# EAGLE design homecontrol (EAGLE 6.3)
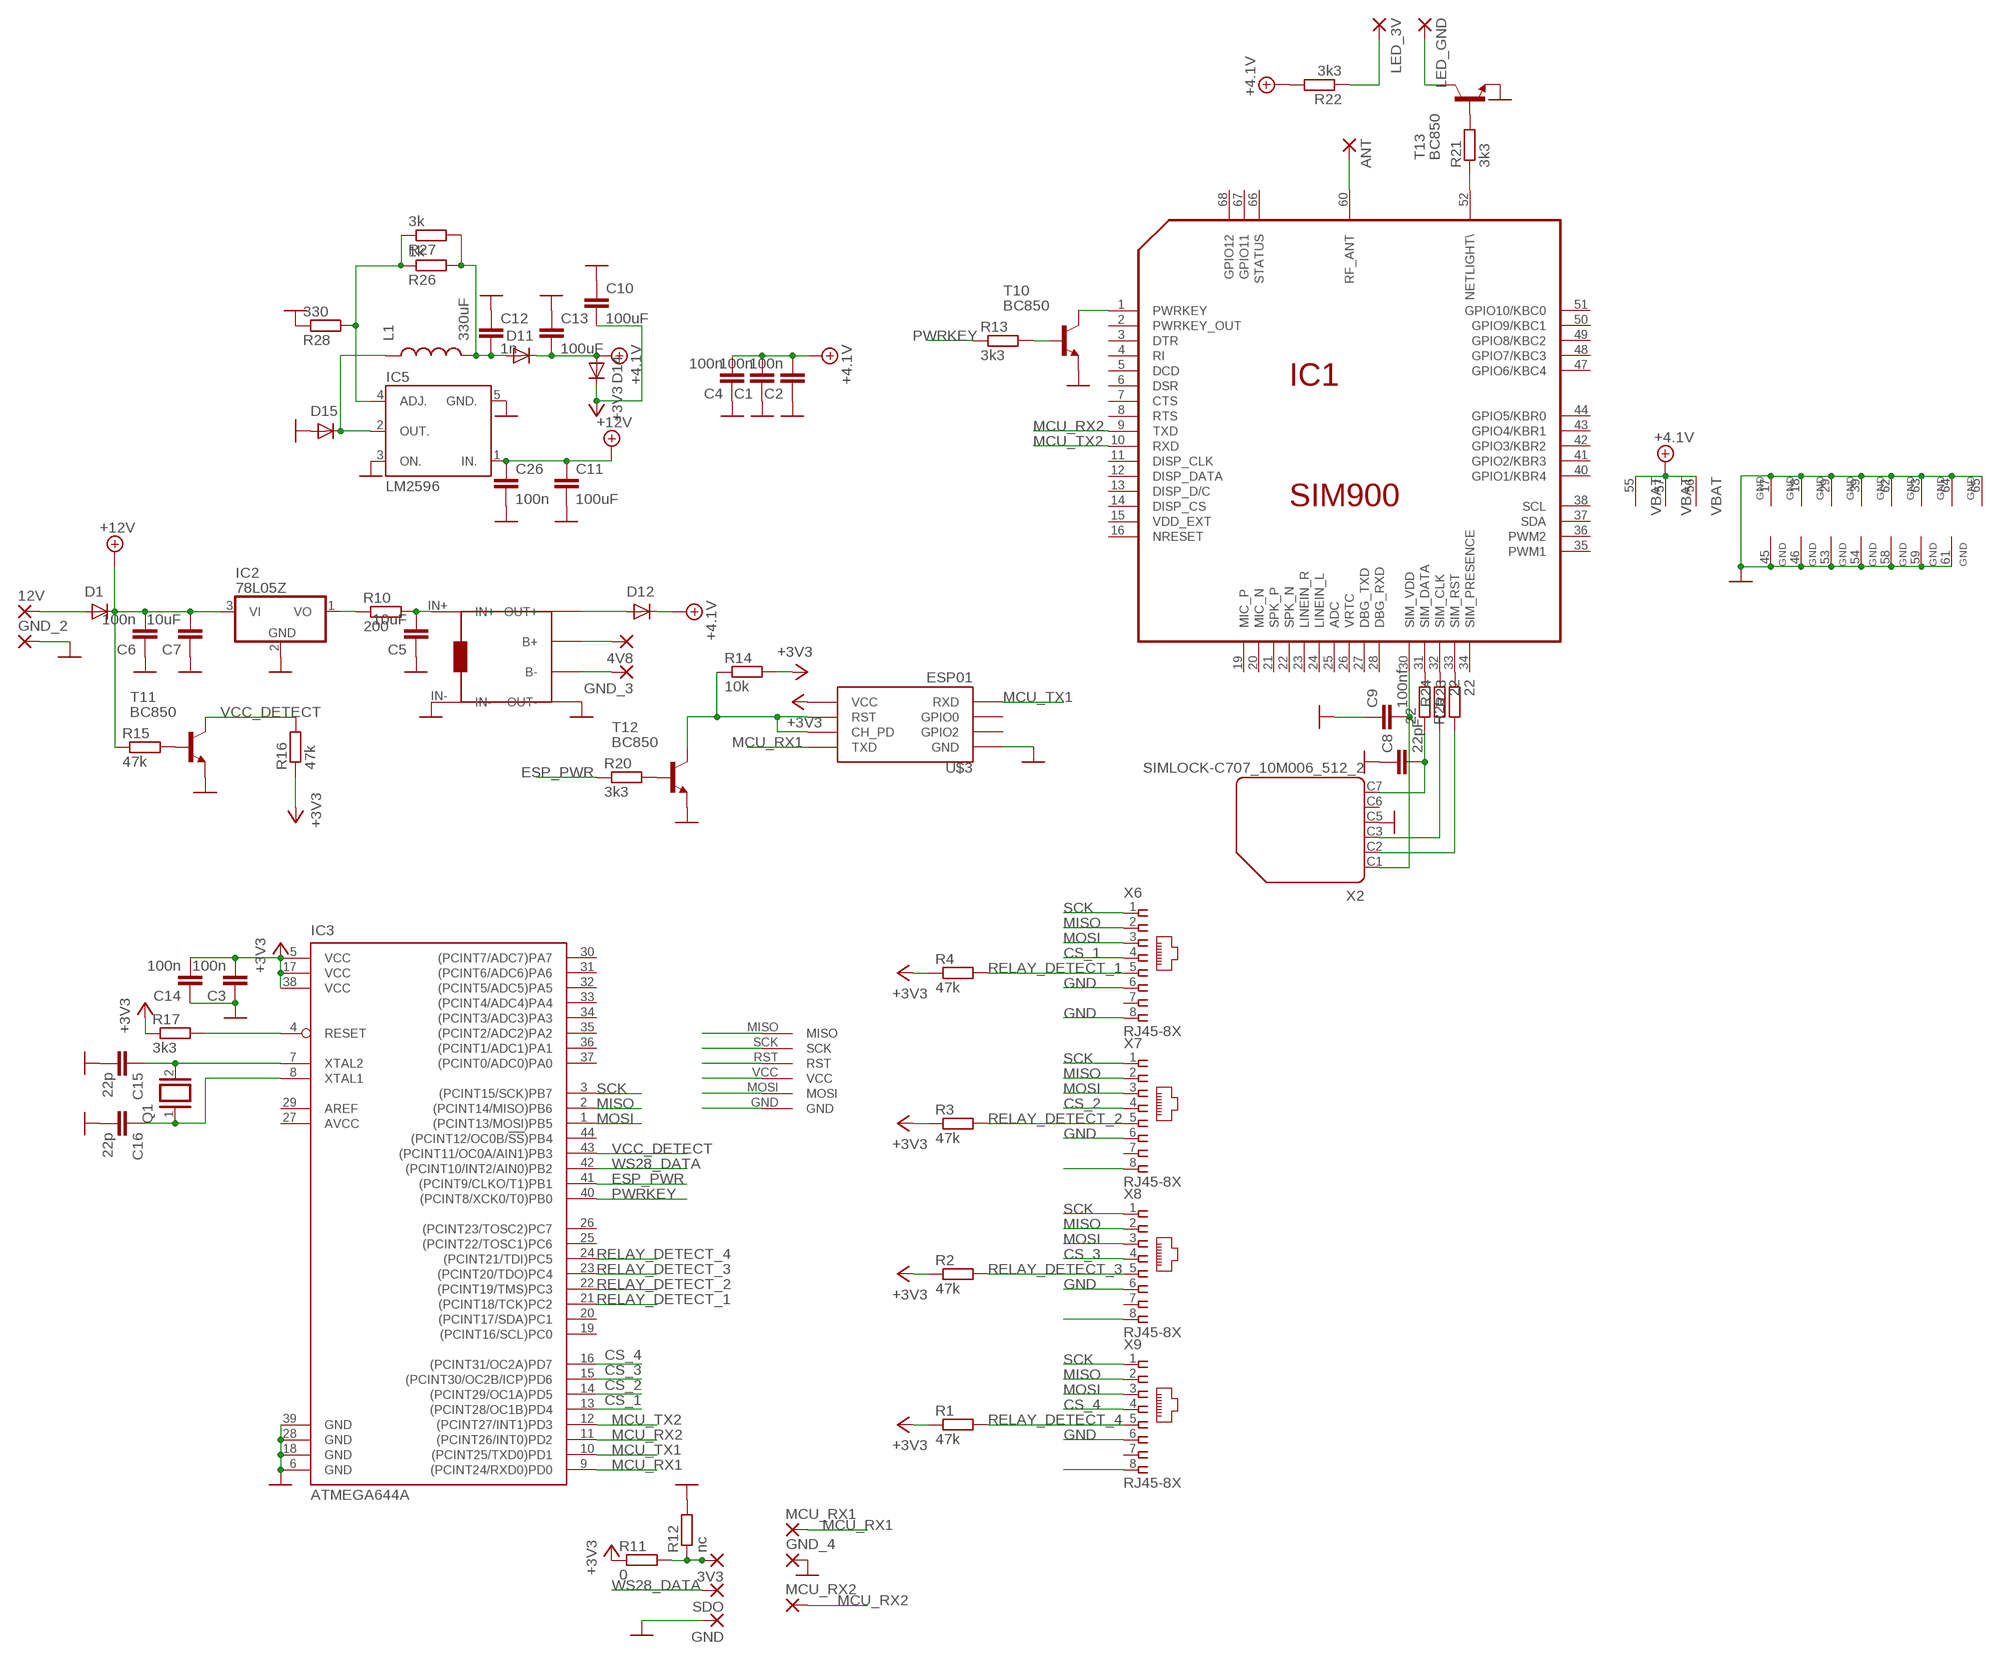
[diagram p0: schematic, sheet 1]

## Parts
3V3  2,15/1,0  [2,15/1,0]
4V8  WIREPAD2,15/1,0  [2,15/1,0]
12V  2,54/0,8  [2,54/0,8]
ANT  2,54/0,8  [2,54/0,8]
C1  100n  C-EUC1206  [C1206]
C2  100n  C-EUC1206  [C1206]
C3  100n  C-EUC1206  [C1206]
C4  100n  C-EUC1206  [C1206]
C5  10uF  C-EUC1206  [C1206]
C6  100n  C-EUC1206  [C1206]
C7  10uF  C-EUC1206  [C1206]
C8  22pF  C-EUC1206K  [C1206K]
C9  100nf  C-EUC1206K  [C1206K]
C10  100uF  SMD-CAP  [SMD-CAP]
C11  100uF  SMD-CAP  [SMD-CAP]
C12  1n  C-EUC1206K  [C1206K]
C13  100uF  C-EU025-050X050  [C025-050X050]
C14  100n  C-EUC1206  [C1206]
C15  22p  C-EUC1206  [C1206]
C16  22p  C-EUC1206  [C1206]
C26  100n  C-EUC1206K  [C1206K]
D1  GF1  [SMA-DO214AC]
D11  GF1  [SMA-DO214AC]
D12  GF1  [SMA-DO214AC]
D14  GF1  [SMA-DO214AC]
D15  GF1  [SMA-DO214AC]
GND  2,54/0,8  [2,54/0,8]
GND_2  2,15/1,0  [2,15/1,0]
GND_3  2,15/1,0  [2,15/1,0]
GND_4  2,15/1,0  [2,15/1,0]
IC1  SIM900  [SIM900]
IC2  78L05Z  [TO92]
IC3  ATMEGA644A  [TQFP44]
IC5  LM2596  LM2931S-ADJ  [TO263-5]
L1  330uF  SMD-INDUCTOR  [SMD-COIL]
LED_3V  WIREPAD2,15/1,0  [2,15/1,0]
LED_GND  WIREPAD2,15/1,0  [2,15/1,0]
MCU_RX1  2,15/1,0  [2,15/1,0]
MCU_RX2  2,15/1,0  [2,15/1,0]
Q1  XTAL/S  [QS]
R1  47k  R-EU_M3216  [M3216]
R2  47k  R-EU_M3216  [M3216]
R3  47k  R-EU_M3216  [M3216]
R4  47k  R-EU_M3216  [M3216]
R10  200  R-EU_M3216  [M3216]
R11  0  R-EU_M3216  [M3216]
R12  nc  R-EU_M3216  [M3216]
R13  3k3  R-EU_M3216  [M3216]
R14  10k  R-EU_M3216  [M3216]
R15  47k  R-EU_M3216  [M3216]
R16  47k  R-EU_M3216  [M3216]
R17  3k3  R-EU_M3216  [M3216]
R20  3k3  R-EU_M3216  [M3216]
R21  3k3  R-EU_M3216  [M3216]
R22  3k3  R-EU_M3216  [M3216]
R23  22  R-EU_M1206  [M1206]
R24  22  R-EU_M1206  [M1206]
R25  22  R-EU_M1206  [M1206]
R26  1k  R-EU_M3216  [M3216]
R27  3k  R-EU_M3216  [M3216]
R28  330  R-EU_M3216  [M3216]
SDO  2,15/1,0  [2,15/1,0]
T10  BC850  [SOT23]
T11  BC850  [SOT23]
T12  BC850  [SOT23]
T13  BC850  [SOT23]
U$1  AVR_ISP  [AVR_ISP]
U$2  AKUTOLTO  [AKUTOLTO]
U$3  ESP01  [ESP01]
X2  SIMLOCK-C707_10M006_512_2  [C707_10M006_512_2]
X6  RJ45-8X  [RJ45-NO-SHIELD]
X7  RJ45-8X  [RJ45-NO-SHIELD]
X8  RJ45-8X  [RJ45-NO-SHIELD]
X9  RJ45-8X  [RJ45-NO-SHIELD]

## Nets
+3V3: C3.2 C10.P$2 C14.2 D14.K(C) IC3.5(VCC) IC3.17(VCC) IC3.38(VCC) R1.1 R2.1 R3.1 R4.1 R11.1 R14.2 R16.1 R17.1 U$1.VCC U$3.VCC
+4.1V: C1.2 C2.2 C4.2 C13.2 D11.K(C) D12.K(C) D14.A IC1.55(VBAT) IC1.56(VBAT) IC1.57(VBAT) R22.2
+12V: C6.2 C7.2 C11.P$1 C26.1 D1.K(C) IC2.3(VI) IC5.1(IN.) R15.1
CS_1: IC3.13((PCINT28/OC1B)PD4) X6.4
CS_2: IC3.14((PCINT29/OC1A)PD5) X7.4
CS_3: IC3.15((PCINT30/OC2B/ICP)PD6) X8.4
CS_4: IC3.16((PCINT31/OC2A)PD7) X9.4
ESP_PWR: IC3.41((PCINT9/CLKO/T1)PB1) R20.1
GND: C1.1 C2.1 C3.1 C4.1 C5.1 C6.1 C7.1 C8.1 C9.1 C10.P$1 C11.P$2 C12.1 C13.1 C14.1 C15.2 C16.2 C26.2 D15.A GND.1(P) GND_2.1(P) GND_4.1(P) IC1.17(GND) IC1.18(GND) IC1.29(GND) IC1.39(GND) IC1.45(GND) IC1.46(GND) IC1.53(GND) IC1.54(GND) IC1.58(GND) IC1.59(GND) IC1.61(GND) IC1.62(GND) IC1.63(GND) IC1.64(GND) IC1.65(GND) IC2.2(GND) IC3.6(GND) IC3.18(GND) IC3.28(GND) IC3.39(GND) IC5.3(ON.) IC5.5(GND.) R12.2 R28.1 T10.2(E) T11.2(E) T12.2(E) T13.2(E) U$1.GND U$2.IN- U$2.OUT- U$3.GND X2.C5 X6.6 X6.8 X7.6 X7.8 X8.6 X8.8 X9.6 X9.8
MCU_RX1: IC3.9((PCINT24/RXD0)PD0) MCU_RX1.1(P) U$3.TX(TXD)
MCU_RX2: IC1.9(TXD) IC3.11((PCINT26/INT0)PD2) MCU_RX2.1(P)
MCU_TX1: IC3.10((PCINT25/TXD0)PD1) U$3.RX(RXD)
MCU_TX2: IC1.10(RXD) IC3.12((PCINT27/INT1)PD3)
MISO: IC3.2((PCINT14/MISO)PB6) U$1.MISO X6.2 X7.2 X8.2 X9.2
MOSI: IC3.1((PCINT13/MOSI)PB5) U$1.MOSI X6.3 X7.3 X8.3 X9.3
N$1: C12.2 D11.A L1.P$2 R26.2 R27.2
N$46: C5.2 R10.2 U$2.IN+
N$47: D12.A U$2.OUT+
N$48: IC2.1(VO) R10.1
N$50: 3V3.1(P) R11.2 R12.1
N$51: R13.2 T10.1(B)
N$52: IC1.1(PWRKEY) T10.3(C)
N$53: D15.K(C) IC5.2(OUT.) L1.P$1
N$54: 12V.1(P) D1.A
N$55: R14.1 T12.3(C) U$3.CH_PD U$3.RST
N$56: 4V8.1(P) U$2.B+
N$57: R15.2 T11.1(B)
N$58: GND_3.1(P) U$2.B-
N$61: C15.1 IC3.7(XTAL2) Q1.2
N$62: R20.2 T12.1(B)
N$63: IC5.4(ADJ.) R26.1 R27.1 R28.2
N$64: ANT.1(P) IC1.60(RF_ANT)
N$65: IC1.52(NETLIGHT\) R21.1
N$66: R21.2 T13.1(B)
N$67: LED_GND.1(P) T13.3(C)
N$68: LED_3V.1(P) R22.1
N$69: C9.2 IC1.30(SIM_VDD) X2.C1
N$70: R23.2 X2.C2
N$71: R24.2 X2.C3
N$72: C8.2 R25.1 X2.C7
N$73: IC1.33(SIM_RST) R23.1
N$74: IC1.32(SIM_CLK) R24.1
N$75: IC1.31(SIM_DATA) R25.2
N$79: C16.1 IC3.8(XTAL1) Q1.1
PWRKEY: IC3.40((PCINT8/XCK0/T0)PB0) R13.1
RELAY_DETECT_1: IC3.21((PCINT18/TCK)PC2) R4.2 X6.5
RELAY_DETECT_2: IC3.22((PCINT19/TMS)PC3) R3.2 X7.5
RELAY_DETECT_3: IC3.23((PCINT20/TDO)PC4) R2.2 X8.5
RELAY_DETECT_4: IC3.24((PCINT21/TDI)PC5) R1.2 X9.5
RESET: IC3.4(RESET) R17.2 U$1.RST
SCK: IC3.3((PCINT15/SCK)PB7) U$1.SCK X6.1 X7.1 X8.1 X9.1
VCC_DETECT: IC3.43((PCINT11/OC0A/AIN1)PB3) R16.2 T11.3(C)
WS28_DATA: IC3.42((PCINT10/INT2/AIN0)PB2) SDO.1(P)
Unconnected: IC1.2(PWRKEY_OUT) IC1.3(DTR) IC1.4(RI) IC1.5(DCD) IC1.6(DSR) IC1.7(CTS) IC1.8(RTS) IC1.11(DISP_CLK) IC1.12(DISP_DATA) IC1.13(DISP_D/C) IC1.14(DISP_CS) IC1.15(VDD_EXT) IC1.16(NRESET) IC1.19(MIC_P) IC1.20(MIC_N) IC1.21(SPK_P) IC1.22(SPK_N) IC1.23(LINEIN_R) IC1.24(LINEIN_L) IC1.25(ADC) IC1.26(VRTC) IC1.27(DBG_TXD) IC1.28(DBG_RXD) IC1.34(SIM_PRESENCE) IC1.35(PWM1) IC1.36(PWM2) IC1.37(SDA) IC1.38(SCL) IC1.40(GPIO1/KBR4) IC1.41(GPIO2/KBR3) IC1.42(GPIO3/KBR2) IC1.43(GPIO4/KBR1) IC1.44(GPIO5/KBR0) IC1.47(GPIO6/KBC4) IC1.48(GPIO7/KBC3) IC1.49(GPIO8/KBC2) IC1.50(GPIO9/KBC1) IC1.51(GPIO10/KBC0) IC1.66(STATUS) IC1.67(GPIO11) IC1.68(GPIO12) IC3.19((PCINT16/SCL)PC0) IC3.20((PCINT17/SDA)PC1) IC3.25((PCINT22/TOSC1)PC6) IC3.26((PCINT23/TOSC2)PC7) IC3.29(AREF) IC3.30((PCINT7/ADC7)PA7) IC3.31((PCINT6/ADC6)PA6) IC3.32((PCINT5/ADC5)PA5) IC3.33((PCINT4/ADC4)PA4) IC3.34((PCINT3/ADC3)PA3) IC3.35((PCINT2/ADC2)PA2) IC3.36((PCINT1/ADC1)PA1) IC3.37((PCINT0/ADC0)PA0) IC3.44((PCINT12/OC0B/!SS!)PB4) U$3.GPIO0 U$3.GPIO2 X2.C6 X6.7 X7.7 X8.7 X9.7

## Power pins joined to a net without a drawn wire
AVCC: IC3.27(AVCC)

## Library data of the parts
3V3 GND_2-GND_4 MCU_RX1 MCU_RX2 SDO = wirepad:2,15/1,0: THROUGH-HOLE PAD
4V8 LED_3V LED_GND = wirepad:WIREPAD: Wire PAD connect wire on PCB
12V ANT GND = wirepad:2,54/0,8: THROUGH-HOLE PAD
C1-C7 C14-C16 = resistor:C-EU: CAPACITOR, European symbol
C8 C9 C12 C13 C26 = rcl:C-EU: CAPACITOR, European symbol
C10 C11 = Tomi's_Library:SMD-CAP
D1 D11 D12 D14 D15 = diode:GF1: DIODE
IC1 = sim900:SIM900
IC2 = linear:78*: Positive VOLTAGE REGULATOR Source: http://cache.national.com/ds/LM/LM78L05.pdf http://www.fairchildsemi.com/ds/LM/LM7805.pdf
IC3 = atmel:ATMEGA644: 8-bit Microcontroller with 64K Bytes In-System Programmable Flash Source: http://www.atmel.com/dyn/resources/prod_documents/doc2593.pdf; MPN: ATMEGA644PV-10AU; OC_FARNELL: 1455123; OC_NEWARK: 58M3748
IC5 = regulator:LM2931?-ADJ: National Semiconductor <http://www.national.com> Low Dropout Adjustable Regulator Vout 3-24V, Vin up to 26V, Shutdown Pin, Reverse Batterie/Load Dump/Short Circuit/Overload Protection,
L1 = Tomi's_Library:SMD-INDUCTOR
Q1 = special:XTAL/S: CRYSTAL
R1-R4 R10-R17 R20-R22 = rcl:R-EU_: RESISTOR, European symbol
R23-R28 = resistor:R-EU_: RESISTOR, European symbol
T10-T13 = transistor:BC850: NPN TRANSISTOR
U$1 = 2 - csatlakozo:AVR_ISP
U$2 = aksitolto:AKUTOLTO
U$3 = esp8266modules:ESP01: ESP8266 Wifi module 01
X2 = con-amphenol:SIMLOCK-C707_10M006_512_2: C707A SIMLOCK® 2.5 mm with wide solder tails Source: Data sheet <http://www.amphenol.info/downloads/C707_10M006_512_2.pdf>; OC_FARNELL: unknown; OC_NEWARK: unknown
X6-X9 = con-tycoelectronics:RJ45: CORCOM Modular RJ Jacks No Shield Source: www.tycoelectronics.com .. ENG_DS_1654001_1099_RJ_L_0507.pdf; MPN: RJ45-8X; OC_FARNELL: unknown; OC_NEWARK: 16R6101

## Net classes
0 default: clearance 0.355 mm

## Board
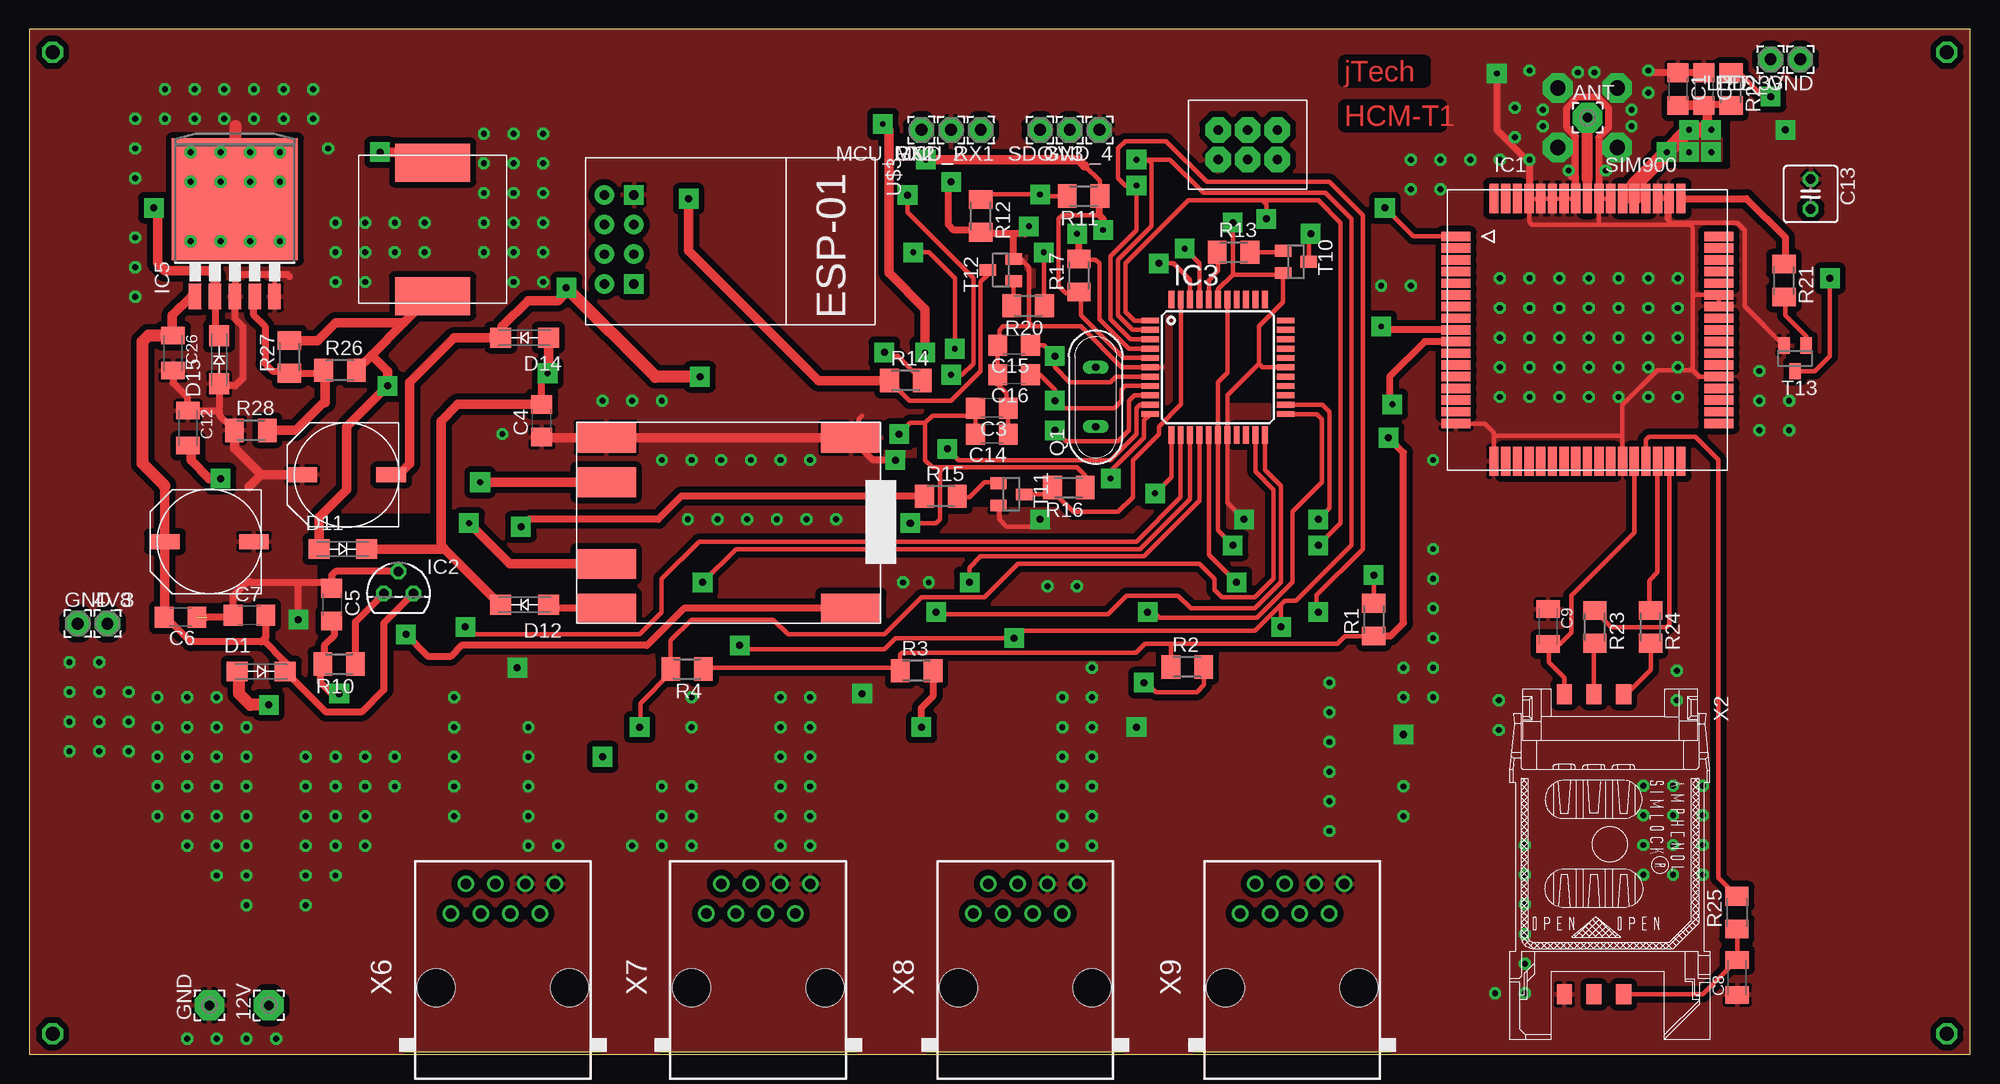
[diagram p1: board, top side]
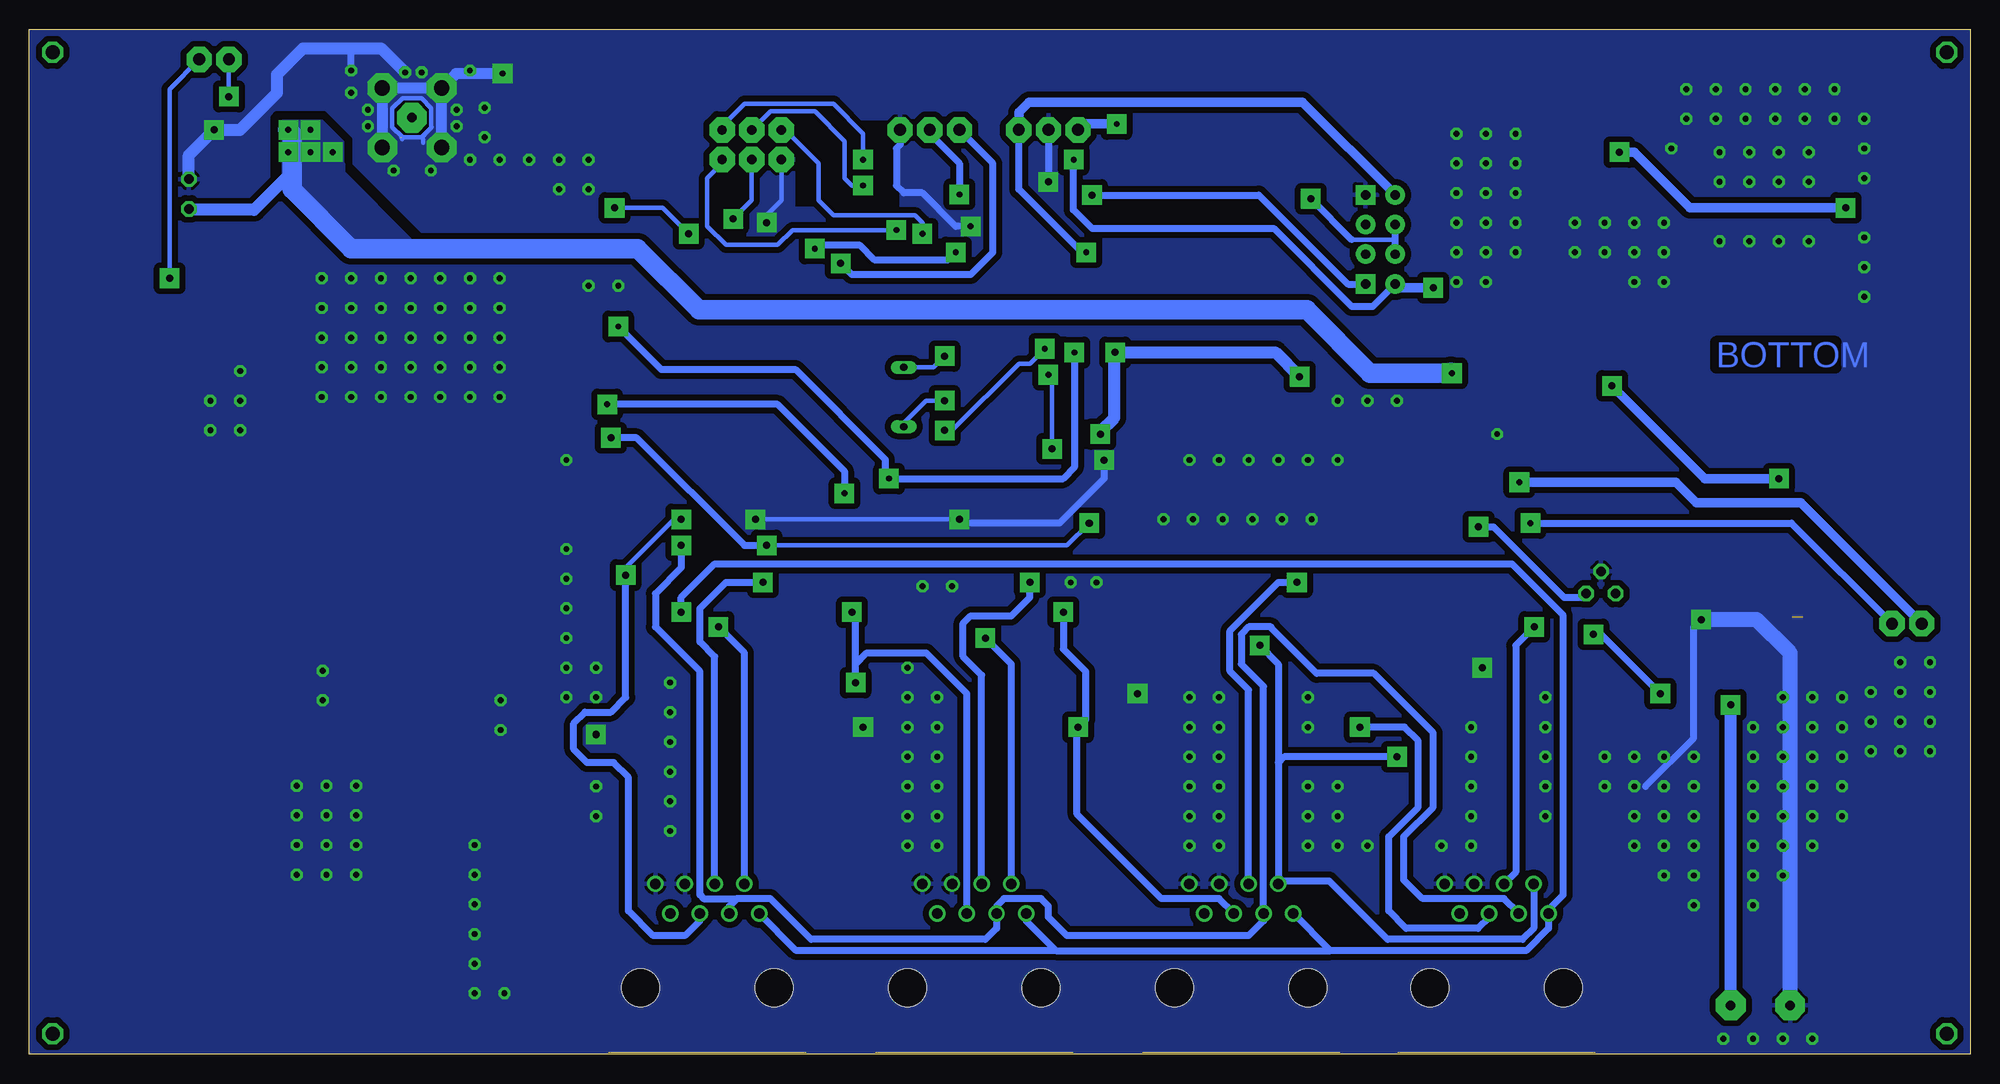
[diagram p2: board, bottom side, seen from below]

Size 166.2 x 87.76 mm. Coordinates in mm from the lower left corner, seen from the top.
Outline: 0,0 166.2,0 166.2,87.76 0,87.76 0,0
Copper layers (1*16): Top 0.035mm / dielectric 1.5mm / Bottom 0.035mm
Design rules "default *": minimum track width 10mil, minimum drill 24mil, track to track 20mil, track to pad 20mil, pad to pad 20mil, via to via 20mil, smd to smd 20mil, copper to edge 1mil, drill to drill 8mil, minimum pad ring 10mil, minimum via ring 8mil, stop-mask expansion 4mil, vias tented up to drill 0mil, thermal gap 10mil
tRestrict: area 76.8,56.1 to 85,64.7; area 75.2,56.1 to 85,57.7; area 77.1,64.4 to 84.7,70.4; area 35.8,40.2 to 39.6,42.8; area 73,46.9 to 91.1,51; area 26.6,39 to 35.5,46.3; area 76.5,69.8 to 82.8,76.1; area 74.9,69.8 to 77.1,75.2; area 95.8,68.8 to 103.1,71.7; area 101.6,68.8 to 103.5,71.7; area 24.7,37 to 28.5,42.1; area 12.7,36.1 to 20.9,38.6; 7 more areas; 2 lines
bRestrict: area 91.7,72.6 to 100.6,79.9; 14 lines

### Footprints (pad centres in the part's own frame; a part is rotated, then mirrored left to right if it is on the bottom)
2,15/1,0 = drill 1.016 pad 2.159 octagon: 1 0,0
2,54/0,8 = drill 0.813 pad 2.54 octagon: 1 0,0
C1206 = smd 1.6 x 1.8: 1 -1.4,0; 2 1.4,0
C1206K = smd 1.5 x 2: 1 -1.5,0; 2 1.5,0
SMD-CAP = smd 1.27 x 2.54: P$1 0,3.81; P$2 0,-3.81
C025-050X050 = drill 0.813 octagon: 1 -1.27,0; 2 1.27,0
SMA-DO214AC = smd 1.8 x 1.7: A -2.05,0; K 2.05,0
SIM900 = smd 2.5 x 0.8: 1 -11.25,8; 2 -11.25,7; 3 -11.25,6; 4 -11.25,5; 5 -11.25,4; 6 -11.25,3; 7 -11.25,2; 8 -11.25,1; 9 -11.25,0; 10 -11.25,-1; 11 -11.25,-2; 12 -11.25,-3; 13 -11.25,-4; 14 -11.25,-5; 15 -11.25,-6; 16 -11.25,-7; 17 -11.25,-8; 35 11.25,-8; 36 11.25,-7; 37 11.25,-6; 38 11.25,-5; 39 11.25,-4; 40 11.25,-3; 41 11.25,-2; 42 11.25,-1; 43 11.25,0; 44 11.25,1; 45 11.25,2; 46 11.25,3; 47 11.25,4; 48 11.25,5; 49 11.25,6; 50 11.25,7; 51 11.25,8 | smd 0.8 x 2.5: 18 -8,-11.25; 19 -7,-11.25; 20 -6,-11.25; 21 -5,-11.25; 22 -4,-11.25; 23 -3,-11.25; 24 -2,-11.25; 25 -1,-11.25; 26 0,-11.25; 27 1,-11.25; 28 2,-11.25; 29 3,-11.25; 30 4,-11.25; 31 5,-11.25; 32 6,-11.25; 33 7,-11.25; 34 8,-11.25; 52 8,11.25; 53 7,11.25; 54 6,11.25; 55 5,11.25; 56 4,11.25; 57 3,11.25; 58 2,11.25; 59 1,11.25; 60 0,11.25; 61 -1,11.25; 62 -2,11.25; 63 -3,11.25; 64 -4,11.25; 65 -5,11.25; 66 -6,11.25; 67 -7,11.25; 68 -8,11.25
TO92 = drill 0.813 octagon: 1 -1.27,0; 2 0,1.905; 3 1.27,0
TQFP44 = smd 1.5 x 0.5: 1 -5.8,4; 2 -5.8,3.2; 3 -5.8,2.4; 4 -5.8,1.6; 5 -5.8,0.8; 6 -5.8,0; 7 -5.8,-0.8; 8 -5.8,-1.6; 9 -5.8,-2.4; 10 -5.8,-3.2; 11 -5.8,-4; 23 5.8,-4; 24 5.8,-3.2; 25 5.8,-2.4; 26 5.8,-1.6; 27 5.8,-0.8; 28 5.8,0; 29 5.8,0.8; 30 5.8,1.6; 31 5.8,2.4; 32 5.8,3.2; 33 5.8,4 | smd 0.5 x 1.5: 12 -4,-5.8; 13 -3.2,-5.8; 14 -2.4,-5.8; 15 -1.6,-5.8; 16 -0.8,-5.8; 17 0,-5.8; 18 0.8,-5.8; 19 1.6,-5.8; 20 2.4,-5.8; 21 3.2,-5.8; 22 4,-5.8; 34 4,5.8; 35 3.2,5.8; 36 2.4,5.8; 37 1.6,5.8; 38 0.8,5.8; 39 0,5.8; 40 -0.8,5.8; 41 -1.6,5.8; 42 -2.4,5.8; 43 -3.2,5.8; 44 -4,5.8
TO263-5 = smd 1.067 x 2.159: 1 -3.404,-5.791; 2 -1.702,-5.791; 3 0,-5.791; 4 1.702,-5.791; 5 3.404,-5.791 | smd 10.8 x 10.41: 6 0,2.54
SMD-COIL = smd 6.452 x 3.251: P$1 0,5.715; P$2 0,-5.715
QS = drill 0.61 long: 1 -2.54,0; 2 2.54,0
M3216 = smd 1.6 x 2: 1 -1.4,0; 2 1.4,0
M1206 = smd 1.6 x 2: 1 -1.4,0; 2 1.4,0
SOT23 = smd 1 x 1.4: 1 -0.95,-1.1; 2 0.95,-1.1; 3 0,1.1
AVR_ISP = drill 0.8 pad 2.184 octagon: GND 0,-2.54; MISO -2.54,2.54; MOSI 0,0; RST -2.54,-2.54; SCK -2.54,0; VCC 0,2.54
AKUTOLTO = smd 2.54 x 5.08: B+ -3.81,10.795; B- 3.175,10.795; IN+ -7.62,-10.16; IN- 6.985,-10.16; OUT+ -7.62,10.795; OUT- 6.985,10.795
ESP01 = drill 0.8 pad 1.676: CH_PD -1.285,-8.178; GPIO0 1.255,-5.638; GPIO2 -1.285,-5.638; RST 1.255,-8.178; TX -3.825,-8.178; VCC 3.795,-8.178 | drill 0.8 pad 1.676 square: GND -3.825,-5.638; RX 3.795,-5.638
C707_10M006_512_2 = smd 1.7 x 1.3: C1 -12.85,-3.915; C2 -12.85,-1.375; C3 -12.85,1.165; C5 12.85,-3.915; C6 12.85,-1.375; C7 12.85,1.165
RJ45-NO-SHIELD = drill 0.9 pad 1.4: 1 -4.445,6.35; 2 -3.175,8.89; 3 -1.905,6.35; 4 -0.635,8.89; 5 0.635,6.35; 6 1.905,8.89; 7 3.175,6.35; 8 4.445,8.89 | hole 3.251: -5.715,0; 5.715,0

### Placement (x,y rotation side)
3V3  89.09,79.14 180 top
4V8  6.7,36.88 0 top
12V  20.51,4.21 90 top
ANT  133.43,80.18 0 top
C1  141.16,82.63 270 top
C2  143.38,82.63 270 top
C3  82.42,55.32 180 top
C4  43.88,54.24 90 top
C5  25.91,38.49 270 top
C6  12.95,37.42 180 top
C7  18.86,37.61 0 top
C8  146.24,6.59 90 top
C9  130.05,36.62 270 top
C10  27.18,49.61 90 top
C11  15.43,43.89 90 top
C12  13.59,53.61 270 top
C13  152.53,73.64 270 top
C14  82.42,53.1 180 top
C15  84.33,60.72 180 top
C16  84.33,58.18 180 top
C26  12.32,60.02 270 top
D1  19.88,32.78 0 top
D11  26.86,43.26 0 top
D12  42.42,38.49 180 top
D14  42.42,61.35 180 top
D15  16.26,59.45 90 top
GND  15.43,4.21 90 top
GND_2  78.93,79.14 180 top
GND_3  4.16,36.88 0 top
GND_4  91.63,79.14 180 top
IC1  133.41,62.01 0 top
IC2  31.62,39.45 0 top
IC3  101.79,58.81 0 top
IC5  17.61,70.66 0 top
L1  34.54,70.63 0 top
LED_3V  149.1,85.17 180 top
LED_GND  151.64,85.17 180 top
MCU_RX1  81.47,79.14 180 top
MCU_RX2  76.39,79.14 180 top
Q1  91.31,56.27 90 top
R1  115.12,37.23 90 top
R2  99.16,33.16 0 top
R3  75.98,32.84 0 top
R4  56.33,33 180 top
R10  26.54,33.41 180 top
R11  90.28,73.47 180 top
R12  81.47,71.77 270 top
R13  103.12,68.66 0 top
R14  75.06,57.67 0 top
R15  78.06,47.78 0 top
R16  89.01,48.51 180 top
R17  89.88,66.67 90 top
R20  85.53,64.09 180 top
R21  150.24,66.24 270 top
R22  145.7,82.62 270 top
R23  134.05,36.59 270 top
R24  138.81,36.59 270 top
R25  146.21,12.14 90 top
R26  26.61,58.56 0 top
R27  22.29,59.7 90 top
R28  18.99,53.42 0 top
SDO  86.55,79.14 180 top
T10  108.46,67.85 270 top
T11  84.09,47.94 270 top
T12  83.18,67.13 90 top
T13  151.19,59.58 180 top
U$1  104.33,76.59 270 top
U$2  60.2,45.8 90 top
U$3  57.42,69.75 270 top
X2  135.35,17.98 270 top
X6  40.56,5.71 0 top
X7  62.42,5.71 0 top
X8  85.28,5.71 0 top
X9  108.14,5.71 0 top

### Tracks (layer width: path | path; a pad name or v marks a point on that pad's centre or on a via)
+3V3  (via drill 0.5 pad 1.68, 0.6 pad 1.68)
  Top 0.406: 76.58,57.55 R14.2 74.34,59.79 73.22,59.79 v73.22,60.09 | R11.1 91.68,74.76 90.36,76.09 | IC3.38 102.59,58.34 101.79,57.55 IC3.17 101.79,44.84 v103.06,43.57 | 91.63,71.83 88.45,71.83 88.14,71.52 88.14,65.8 88.77,65.17 89.77,65.17 R17.1 90.04,65.11 90.04,63.26 93.69,59.62 IC3.5 | R16.1 90.41,49.56 89.72,50.24 78.3,50.24 | 78.3,50.24 77.34,50.24 76.71,50.88 76.71,54.05 | v75.44,45.48 77.66,45.48 77.98,45.8 77.98,49.92 78.3,50.24 | 76.71,54.05 75.44,54.05 v74.48,53.1 | C3.2 C14.2 81.02,55.13 80.83,55.32 80.83,54.69 77.34,54.69 76.71,54.05 | 97.74,35.14 97.74,33.17 R2.1 | 97.74,35.14 95.52,35.14 94.74,34.37 74.74,34.37 74.56,34.19 74.56,32.85 R3.1 74.36,33.1 57.73,33.1 R4.1 | 97.74,35.14 112.03,35.14 112.67,35.78 115.08,35.78 R1.1
  Top 0.61: R11.1 91.63,73.42 91.63,71.83 91.95,71.52 v91.95,70.56 | R1.1 116.58,35.82 117.67,36.91 117.67,51.51 v116.39,52.78
  Top 0.813: 90.36,76.09 89.85,76.59 v76.77,76.59 | C10.P$2 31.62,49.61 32.58,50.56 32.58,57.55 36.38,61.35 D14.K 40.51,61.5 40.51,62.31 42.73,64.53 45.27,64.53 45.75,65.01 45.75,65.39 v45.99,65.62
  Top 1.016: v57.42,58 53.61,58 v45.99,65.62
  Bottom 0.406: v91.95,70.56 100.84,70.56 102.11,69.29 106.55,69.29 108.14,70.88 108.14,75.01 106.87,76.28 U$1.VCC | v103.06,43.57 77.34,43.57 v75.44,45.48
  Bottom 0.61: v103.06,43.57 104.97,43.57 114.17,52.78 v116.39,52.78 | v76.77,76.59 76.79,76.58 76.79,72.29 75.2,70.71 59.64,70.71 52.98,64.04 51.16,64.04 U$3.VCC
  Bottom 0.813: v45.99,65.62 48.91,65.62 U$3.VCC
  Bottom 1.016: v57.42,58 59.5,60.09 v73.22,60.09 73.3,60.01 73.3,54.51 74.48,53.32 v74.48,53.1
+4.1V  (via drill 0.5 pad 1.68)
  Top 0.61: IC1.55 IC1.56 IC1.57 | C4.2 43.88,57.8 v44.39,58.31 | 143.32,79.52 143.7,79.14 | 35.26,43.57 35.29,43.57 | 143.7,80.91 143.7,81.08 143.93,81.31 145.62,81.31 R22.2
  Top 0.813: C4.2 36.7,55.64 35.26,54.2 35.26,43.57 35.58,43.26 | 44.32,58.37 v44.39,58.31 44.47,58.39 D14.A | C1.2 C2.2 143.7,80.91 143.7,79.45 143.64,79.52 143.32,79.52 | D12.K 40.34,38.49 35.58,43.26 | D11.K 35.58,43.26
  Top 1.27: IC1.56 137.41,74.43 v140.21,77.23 v142.11,79.14 143.7,79.14 v144.02,79.14 144.08,79.14
  Bottom 1.016: v144.02,77.23 144.02,75.23 146.96,72.29 152.45,72.29 C13.2
  Bottom 1.676: 144.08,79.14 143.7,78.75 143.7,74.06 138.62,68.98 114.11,68.98 108.86,63.72 56.78,63.72 51.39,58.32 44.4,58.32 v44.39,58.31 44.47,58.39
  other vias: 142.11,77.23
  pour Bottom: 138.3,68.98 138.62,68.98 144.02,74.37
  pour Top: 139.57,76.59 145.29,76.59 145.92,77.23 144.02,79.14 142.11,79.14
  pour Bottom: 144.41,79.91 141.24,79.91 139.34,78.01 139.34,75.47 133.62,69.75 133.62,68.8 138.7,68.8 142.19,72.29 144.41,74.52
+12V  (via drill 0.6 pad 1.68)
  Top 0.61: v42.1,45.16 42.73,45.8 53.85,45.8 55.83,47.78 R15.1 | 20.03,35.48 20.26,35.7 C7.2 | 20.03,35.48 19.88,35.32 13.84,35.32 11.62,37.54 11.62,38.49 11.62,39.89 C6.2 | IC2.3 30.35,36.91 30.35,31.19 28.45,29.29 25.42,29.29 D1.K 21.93,33.59 20.03,35.48
  Top 0.813: IC5.1 13.86,64.87 12.26,63.26 12.26,61.59 C26.1 | 11.6,48.67 11.62,48.67 C11.P$1 11.62,38.49
  Top 1.016: C26.1 10.2,61.52 9.71,61.04 9.71,50.56 11.6,48.67
  Bottom 0.61: v42.1,45.16 40.83,45.16 34.8,39.13 33.21,39.13 IC2.3
CS_1  (via drill 0.6 pad 1.68)
  Top 0.406: IC3.13 98.59,47.68 94.81,43.89 57.34,43.89 54.16,40.72 54.16,37.86 52.26,35.95 37.97,35.95 v37.34,36.59
  Bottom 0.61: v37.34,36.59 38.92,35 38.92,15.6 X6.4
CS_2  (via drill 0.6 pad 1.68)
  Top 0.406: IC3.14 99.39,47.52 95.12,43.26 60.52,43.26 v57.66,40.4
  Bottom 0.61: v57.66,40.4 59.24,40.4 63.37,36.27 63.37,32.78 61.78,31.19 X7.4
CS_3  (via drill 0.6 pad 1.68)
  Top 0.406: IC3.15 100.19,47.37 95.44,42.62 81.47,42.62 80.52,41.67 v80.52,40.4
  Bottom 0.61: v80.52,40.4 80.52,39.13 82.11,37.54 85.6,37.54 86.23,36.91 86.23,34.05 84.64,32.46 X8.4
CS_4  (via drill 0.6 pad 1.68)
  Top 0.406: IC3.16 100.99,42.79 v103.38,40.4
  Bottom 0.61: X9.4 107.5,34.05 108.78,35.32 108.78,38.18 106.55,40.4 v103.38,40.4
ESP_PWR  (via drill 0.5 pad 1.68)
  Top 0.406: 86.87,65.17 86.87,63.83 R20.1 86.87,64.47 v86.87,68.66 | IC3.41 100.19,67.72 v98.93,68.98
  Bottom 0.61: v98.93,68.98 98.61,69.29 95.12,69.29 93.85,68.02 87.5,68.02 v86.87,68.66
GND  (via drill 0.5 pad 1.02, 0.5 pad 1.68, 0.6 pad 1.68, 1.3 pad 2.54)  (2 unrouted)
  Top 0.206: 132.43,74.05 132.41,74.03 IC1.61
  Top 0.406: IC1.39 142.98,58.01 142.43,58.56 142.43,58.81 | 142.43,58.81 142.43,64.91 | 142.43,64.91 142.43,70.75 142.18,71.01 140.4,71.01 | 140.4,71.01 134.56,71.01 | 134.56,71.01 128.71,71.01 128.46,71.26 128.46,73.22 | 128.46,73.22 IC1.65 | 128.46,73.22 129.36,73.22 IC1.64 IC1.63 IC1.62 IC1.61 | IC1.58 IC1.59 134.41,71.15 134.56,71.01 | IC1.54 IC1.53 140.41,71.02 140.4,71.01 | IC1.45 IC1.46 142.53,65.01 142.43,64.91 | 142.43,58.81 142.18,58.56 139.38,58.56 136.41,55.59 IC1.29 136.41,52.89 136.33,52.97 125.41,52.97 | IC1.18 125.41,52.97 | 125.41,52.97 125.41,53.23 124.65,53.99 122.19,53.99 IC1.17 | 140.21,73.47 140.21,71.52 140.53,71.2 146.24,71.2 146.88,70.56 146.88,64.05 T13.2 | 105.28,59.13 102.59,56.44 IC3.18 102.59,47.22 v104.01,45.8 | 96.71,58.81 IC3.6 93.53,58.81 90.04,62.31 85.92,62.31 | 85.92,62.31 85.6,62.62 85.6,67.39 84.96,68.02 84.35,68.02 T12.2 | 85.92,62.31 83.38,62.31 83.06,61.99 83.06,60.85 C15.2 C16.2 82.93,57.36 83.69,56.59 83.69,55.45 C3.1 C14.1 | IC5.5 21.01,66.62 21.14,66.75 | IC3.39 101.79,65.48 103.06,66.75 | 103.06,66.75 v103.06,71.2 | 103.06,66.75 107.21,66.75 T10.2 107.36,64.38 105.28,62.31 105.28,59.13 | T11.2 83.06,46.92 83.06,45.8 83.69,45.16 85.92,45.16 v86.55,45.8 | 71.31,54.69 70.99,54.37 70.99,52.78 | IC3.28 105.6,58.81 105.28,59.13
  Top 0.61: v125.67,83.96 125.67,79.14 128.46,76.34 128.46,73.31 IC1.65 | 140.21,73.47 IC1.53 | 16.07,55.11 C12.1 13.53,55.17 13.53,56.27 12.32,57.48 C26.2 | 16.07,55.11 16.28,55.11 16.28,54.72 R28.1 | 22.28,66.57 22.1,66.75 21.14,66.75 17.97,66.75 17.65,66.44 17.65,64.91 IC5.3 17.61,62.99 18.29,62.31 18.29,57.86 17.65,57.23 16.43,57.23 D15.A 16.26,55.3 16.07,55.11 | v85.6,70.88 85.6,70.56 85.28,70.25 84.33,70.25 | 84.33,70.25 81.59,70.25 R12.2 81.28,70.56 79.15,70.56 78.69,71.02 78.69,74.52 79.01,74.83 | T12.2 84.28,70.2 84.33,70.25 | 132.02,75.15 132.4,75.15 | 132.4,75.15 132.4,75.2 | 132.4,75.2 132.4,78.58 131.66,79.31 131.66,81.04 132.57,81.95 134.28,81.95 135.22,81.02 135.22,79.34 134.38,78.5 134.38,74.23 134.4,74.21 | 132.37,74.21 132.37,75.17 132.4,75.2 | 132.4,75.15 132.4,74.21 | C2.1 C1.1 138.81,84.03 v138.62,84.22 | 131.35,5.22 X2.C5 131.54,5.03 | IC2.2 26.23,41.35 25.91,41.03 C5.1 25.4,40.4 22.73,40.4 | 18.92,40.4 18.61,40.4 17.46,39.25 C7.1 17.27,37.42 15.24,37.42 | 18.92,40.4 22.73,40.4 | v23.05,37.23 23.05,40.08 22.73,40.4 | 72.26,52.78 70.99,52.78 U$2.IN- 72.26,50.88 v74.17,50.88 | 18.85,40.47 18.92,40.4
  Top 0.813: C4.1 43.94,52.78 U$2.OUT- U$2.IN- | R28.1 17.59,51.9 19.88,49.61 | 19.88,49.61 23.48,49.61 | 18.85,48.58 19.88,49.61
  Top 1.016: 17.65,79.45 17.65,77.55
  Bottom 0.406: U$1.GND 101.79,73.1 103.06,71.83 v103.06,71.2 | 132.46,78.02 132.46,78.33 132.5,78.37 132.5,78.61 131.79,79.33 131.79,79.34 131.75,79.37 131.75,79.42 131.76,79.43 131.76,81 132.62,81.85 134.24,81.85 135.12,80.97 135.12,79.38 134.28,78.55 134.28,78.52 134.27,78.51 134.27,78.34 | 132.35,78.7 132.55,78.5 134.37,78.5 | 103.69,46.12 v104.01,45.8 v86.55,45.8
  Bottom 0.61: GND_4.1 91.63,77.87 91.95,77.55 91.95,74.37 91.31,73.74 89.72,73.74 86.87,70.88 v85.6,70.88 | v138.62,84.22 138.62,86.12 | v23.05,37.23 23.68,36.59 23.68,27.06 27.81,22.94 | v74.17,50.88 74.17,49.29 77.98,45.48 86.23,45.48 v86.55,45.8 | GND_2.1 v78.93,74.69
  Bottom 0.93: v130.89,77.64 v130.89,82.72 | v130.89,82.72 v135.97,82.72 v135.97,77.64 | v125.67,83.96 129.64,83.96 v130.89,82.72
  Bottom 1.016: v134,84.06 136.06,86.12 138.62,86.12 142.75,86.12 144.97,83.9 144.97,82.31 148.15,79.14 v150.37,79.14 152.53,76.98 C13.1
  Bottom 1.27: GND.1 15.43,34.37 18.29,37.23 v23.05,37.23
  other vias: 131.8,75.66 135,75.66 129.6,79.46 129.6,80.86 137.2,79.46 137.2,80.86 132.6,84.06 26.23,66.12 26.23,68.66 9.08,67.39 9.08,69.93 9.08,75.01 9.08,77.55 9.08,64.85 118.3,76.59 120.84,76.59 123.38,76.59 125.92,76.59 128.46,76.59 127.19,78.5 127.19,81.04 118.3,74.06 120.84,74.06 128.46,84.22 138.62,82.31 125.92,66.44 128.46,66.44 131,66.44 133.54,66.44 136.08,66.44 138.62,66.44 141.16,66.44 138.62,63.9 136.08,63.9 133.54,63.9 131,63.9 128.46,63.9 125.92,63.9 125.92,61.35 125.92,58.81 128.46,58.81 128.46,61.35 131,61.35 131,58.81 133.54,58.81 133.54,61.35 136.08,58.81 136.08,61.35 138.62,61.35 138.62,58.81 141.16,58.81 141.16,63.9 141.16,61.35 13.84,77.23 16.38,77.23 18.92,77.23 21.46,77.23 21.46,74.69 21.46,69.61 18.92,69.61 16.38,69.61 13.84,69.61 18.92,74.69 16.38,74.69 13.84,74.69 26.23,71.2 28.77,68.66 31.3,68.66 33.84,68.66 33.84,71.2 31.3,71.2 28.77,71.2 28.77,66.12 41.47,76.28 44.01,78.82 41.47,78.82 117.67,27.38 41.47,73.74 41.47,71.2 41.47,68.66 41.47,66.12 54.16,55.96 54.16,50.88 56.7,50.88 59.24,50.88 61.78,50.88 64.33,50.88 66.86,50.88 51.62,55.96 49.09,55.96 120.2,50.88 120.2,43.26 125.92,56.27 128.46,56.27 131,56.27 133.54,56.27 136.08,56.27 138.62,56.27 141.16,56.27 125.51,5.22 120.2,40.72 128.05,5.22 128.05,7.76 128.05,10.3 128.05,12.84 128.05,15.38 128.05,17.92 143.29,20.46 143.29,23 140.75,23 140.75,20.46 138.21,20.46 138.21,23 138.21,17.92 140.75,17.92 143.29,17.92 143.29,15.38 140.75,15.38 138.21,15.38 148.15,53.42 148.15,55.96 148.15,58.5 150.69,53.42 150.69,55.96 117.67,33.1 117.67,30.56 120.2,30.56 120.2,33.1 120.2,35.64 120.2,38.18 31.3,25.48 28.77,25.48 26.23,25.48 23.68,25.48 23.68,22.94 23.68,20.4 23.68,17.86 21.14,1.35 16.07,1.35 18.61,1.35 13.53,1.35 10.98,20.4 10.98,22.94 10.98,25.48 13.53,25.48 16.07,25.48 18.61,25.48 16.07,22.94 13.53,22.94 13.53,28.02 16.07,28.02 18.61,28.02 13.53,30.56 16.07,30.56 10.98,28.02 3.45,31.02 3.45,28.48 3.45,25.94 3.45,33.56 10.98,30.56 28.77,22.94 28.77,20.4 28.77,17.86 26.23,17.86 26.23,20.4 26.23,22.94 31.3,22.94 117.67,20.4 117.67,22.94 89.72,40.08 87.19,40.08 69.09,45.8 66.55,45.8 64.01,45.8 58.93,45.8 61.47,45.8 56.39,45.8 40.51,53.1 115.76,65.8 118.3,65.8 125.83,27.76 125.83,30.3 141.06,30.3 141.06,32.84 71.31,30.88 41.78,33.1 94.81,28.02 77.03,40.4 74.8,40.4 5.99,33.56 5.99,31.02 5.99,28.48 5.99,25.94 8.53,25.94 8.53,28.48 8.53,31.02 13.53,20.4 23.68,15.32 26.23,15.32 23.68,12.78 16.07,20.4 18.61,20.4 18.61,22.94 18.61,17.86 16.07,17.86 13.53,17.86 16.07,15.32 18.61,15.32 18.61,12.78 111.31,19.13 111.31,21.67 111.31,24.21 111.31,26.75 111.31,29.29 111.31,31.83 88.45,17.86 91,17.86 91,20.4 88.45,20.4 88.45,22.94 91,22.94 91,25.48 88.45,25.48 88.45,28.02 88.45,30.56 91,30.56 91,33.1 91,28.02 64.33,17.86 64.33,20.4 64.33,22.94 64.33,25.48 64.33,28.02 64.33,30.56 66.86,30.56 66.86,28.02 66.86,25.48 66.86,22.94 66.86,20.4 66.86,17.86 42.73,17.86 45.27,17.86 42.73,20.4 42.73,22.94 42.73,25.48 42.73,28.02 51.62,17.86 54.16,17.86 56.7,17.86 56.7,20.4 56.7,22.94 54.16,22.94 54.16,20.4 56.7,28.02 56.7,30.56 36.38,22.94 36.38,25.48 36.38,28.02 36.38,30.56 36.38,20.4 44.01,76.28 44.01,73.74 44.01,71.2 44.01,68.66 44.01,66.12 38.92,68.66 38.92,71.2 38.92,73.74 38.92,76.28 38.92,78.82 9.08,77.55 9.08,80.09 11.62,80.09 14.16,80.09 16.7,80.09 19.24,80.09 21.78,80.09 24.32,80.09 25.59,77.55 24.32,82.63 21.78,82.63 19.24,82.63 16.7,82.63 14.16,82.63 11.62,82.63
  pour Top: -0.03,87.73 166.22,87.83 166.22,0 0.07,-0.1
  pour Bottom: 0.06,-0.1 166.21,0 166.21,87.83 -0.04,87.73
MCU_RX1  (via drill 0.5 pad 1.68, 0.6 pad 1.68)
  Top 0.406: v75.69,68.66 77.03,68.66 79.25,66.44 v79.25,60.4 | v87.82,53.42 88.77,52.46 93.22,52.46 94.17,53.42 94.17,55.96 94.63,56.41 IC3.9
  Bottom 0.406: v87.82,53.42 87.19,53.42 81.47,59.13 80.52,59.13 v79.25,60.4
  Bottom 0.61: v75.69,68.66 76.07,68.66 81.47,74.06 MCU_RX1.1
  Bottom 0.813: MCU_RX1.1 81.47,80.63 80.6,81.5 57.16,81.5 U$3.TX
MCU_RX2  (via drill 0.5 pad 1.68)
  Top 0.406: 96.08,54.81 IC3.11 95.44,54.27 95.44,52.78 92.58,49.92 v92.58,49.29
  Top 0.61: IC1.9 116.06,62.01 v115.76,62.31
  Top 0.813: v76.71,60.09 76.71,63.8 73.61,66.9 73.61,79.12 v73.09,79.64
  Bottom 0.61: 92.74,49.45 v92.58,49.29 | v92.58,49.29 77.66,49.29 76.71,50.24 v76.71,60.09 | v92.58,49.29 92.9,49.61 92.9,50.94 100.6,58.64 112.09,58.64 v115.76,62.31
  Bottom 0.813: v73.09,79.64 75.88,79.64 MCU_RX2.1
MCU_TX1  (via drill 0.5 pad 1.68, 0.6 pad 1.68)
  Top 0.406: v78.61,51.83 79.56,50.88 92.58,50.88 94.81,53.1 94.81,55.32 95.1,55.62 IC3.10 | v78.93,58.18 79.88,58.18 80.83,59.13 80.83,66.44 75.2,72.07 v75.2,73.56
  Bottom 0.406: v78.61,51.83 78.61,57.86 v78.93,58.18
  Bottom 0.61: v75.2,73.56 60.91,73.56 53.29,65.94 51.8,65.94 U$3.RX
MCU_TX2  (via drill 0.5 pad 1.68)
  Top 0.406: IC3.12 97.79,49.42 v96.39,48.02
  Top 0.61: IC1.10 119.48,61.01 116.47,58 116.47,55.88 v116.71,55.64
  Bottom 0.61: v96.39,48.02 96.39,49.92 102.11,55.64 v116.71,55.64
MISO  (via drill 0.5 pad 1.68, 0.6 pad 1.68)
  Top 0.406: IC3.2 94.46,62.01 93.22,63.26 93.22,68.02 96.08,70.88 96.08,76.28 95.76,76.59 | 95.76,76.59 97.66,76.59 100.52,73.74 111,73.74 113.22,71.52 113.22,43.57 108.46,38.81 107.5,38.81 107.19,38.49 | v107.19,36.59 107.19,38.49 | v94.81,76.59 95.76,76.59 | 107.19,38.49 104.97,36.27 84.96,36.27 v84.33,35.64 74.17,35.64 73.22,34.68 61.15,34.68 v60.83,35
  Bottom 0.406: U$1.MISO 106.87,79.45 104.97,81.36 97.34,81.36 94.81,78.82 v94.81,76.59
  Bottom 0.61: X9.2 104.97,34.37 v107.19,36.59 | X6.2 37.38,10.79 38.34,9.84 49.9,9.84 54.88,14.83 59.02,14.83 X7.2 59.24,24.98 | v60.83,35 59.24,33.41 59.24,24.98 | 49.23,25.62 v49.09,25.48 58.75,25.48 59.24,24.98 | X8.2 82.11,33.41 v84.33,35.64
MOSI  (via drill 0.6 pad 1.68)
  Top 0.406: IC3.1 94.61,62.82 93.85,63.58 93.85,67.71 99.25,73.1 105.6,73.1 | 105.6,73.1 110.36,73.1 112.27,71.2 112.27,45.48 v110.36,43.57 | v105.92,71.52 105.92,72.79 105.6,73.1
  Bottom 0.406: U$1.MOSI 104.33,73.1 v105.92,71.52
  Bottom 0.61: v110.36,43.57 110.36,41.67 112.58,39.45 112.58,36.59 108.78,32.78 108.78,13.65 108.46,13.33 105.6,13.33 | 105.6,13.33 102.74,13.33 99.25,9.84 84.33,9.84 83.38,10.79 X8.3 83.38,12.7 82.74,13.33 79.56,13.33 78.93,12.7 78.93,11.75 77.34,10.16 61.78,10.16 60.52,11.43 X7.3 60.52,31.51 62.42,33.41 62.42,35.95 61.78,36.59 59.96,36.59 | 105.6,13.33 106.23,12.7 X9.3 | X6.3 39.92,13.33 46.91,13.33 48.5,14.92 48.5,18.67 45.99,21.17 45.99,27.52 51.07,32.6 55.98,32.6 59.96,36.59 | 59.88,36.59 59.96,36.59
N$1  (via drill 0.6 pad 1.68)
  Top 0.61: 28.13,58.68 R26.2
  Top 0.813: 13.53,52.05 C12.2 13.88,52.11 13.88,50.84 15.43,49.29 v16.38,49.29 | 28.07,58.56 R26.2 29.31,59.86 | R27.2 24.7,61.1 26.23,62.62 32.07,62.62 | 29.31,59.86 30.67,58.5 v30.67,57.23 27.18,53.73 27.18,48.34 24.81,45.97 D11.A | 29.31,59.86 32.07,62.62 | L1.P$2 34.36,64.91 32.07,62.62
  Bottom 0.813: v30.67,57.23 22.73,49.29 v16.38,49.29
N$3  (via drill 1.2 pad 1.42)
  other vias: 164.2,1.78
N$4  (via drill 1.2 pad 1.42)
  other vias: 2,1.78
N$5  (via drill 1.2 pad 1.42)
  other vias: 2,85.78
N$6  (via drill 1.2 pad 1.42)
  other vias: 164.2,85.78
N$46  (via drill 0.6 pad 1.68)
  Top 0.61: C5.2 26.09,36.91 26.09,35.82 25.27,35 25.27,33.55 R10.2 24.95,33.23 24.95,31.83 25.91,30.88 v26.54,30.88 | 32.26,35.64 v32.26,35.95 34.16,34.05 36.07,34.05 37.02,35 52.9,35 56.07,38.18 U$2.IN+
  Bottom 0.61: v32.26,35.95 31.62,35.95 v26.54,30.88
N$47
  Top 0.61: U$2.OUT+ 44.78,38.18 D12.A
N$48
  Top 0.61: IC2.1 27.94,37.04 R10.1
N$50  (via drill 0.5 pad 1.68)
  Top 0.406: R11.2 86.69,73.47 v86.55,73.61 81.91,73.61 R12.1
  Bottom 0.61: 3V3.1 89.09,78.82 86.55,76.28 v86.55,73.61
N$51
  Top 0.406: R13.2 107.22,68.66 T10.1
N$52  (via drill 0.6 pad 1.68)
  Top 0.406: 122.08,69.93 IC1.1 118.53,70.01 v116.08,72.47 | T10.3 109.56,70.08 v109.73,70.25
  Bottom 0.406: v109.73,70.25 111.95,72.47 v116.08,72.47
N$53  (via drill 0.6 pad 1.68)
  Top 0.61: IC5.2 15.91,61.85 D15.K
  Top 0.813: IC5.2 15.91,66.59 15.43,67.07 11.62,67.07 10.98,67.71 10.98,72.15 v10.67,72.47 | v30.04,77.23 33.65,77.23 L1.P$1
  Bottom 0.813: v10.67,72.47 24,72.47 28.77,77.23 v30.04,77.23
N$54  (via drill 0.6 pad 1.68)
  Top 1.016: v20.51,29.92 18.92,29.92 17.97,30.88 17.97,32.63 D1.A
  Bottom 1.016: 12V.1 v20.51,29.92
N$55  (via drill 0.6 pad 1.68)
  Top 0.406: 73.53,57.55 R14.1 75.37,55.96 78.93,55.96 81.47,58.5 81.47,66.12 82.08,66.73 T12.3
  Top 0.813: R14.1 67.6,57.67 56.47,68.8 v56.47,73.25
  Bottom 0.406: 52.98,69.75 49.24,69.75 49.24,69.44
  Bottom 0.61: v56.47,73.25 52.98,69.75 | U$3.RST 49.24,69.44 U$3.CH_PD
N$56  (via drill 0.5 pad 1.68)
  Top 0.813: U$2.B+ 41.15,41.99 v37.66,45.48
  Bottom 0.61: v37.66,45.48 15.3,45.48 4V8.1
N$57
  Top 0.406: T11.1 82.91,48.97 81.79,48.97 80.52,47.7 79.53,47.7 R15.2
N$58  (via drill 0.5 pad 1.68)
  Top 0.813: U$2.B- v38.61,48.97
  Bottom 0.813: v38.61,48.97 25.21,48.97 23.45,47.21 14.49,47.21 GND_3.1
N$61  (via drill 0.6 pad 1.68)
  Top 0.406: IC3.7 93.05,58.02 92.58,57.55 89.09,57.55 87.82,58.81 v87.82,59.77 86.87,60.72 C15.1
  Bottom 0.406: Q1.2 88.77,58.81 v87.82,59.77
N$62
  Top 0.406: T12.1 84.28,63.92 R20.2
N$63
  Top 0.61: R26.1 24.95,58.3 R27.1 22.09,58.5 20.83,58.5 20.19,59.13 20.19,62.31 19.24,63.26 19.24,64.8 IC5.4
  Top 0.813: 25.34,55.77 25.34,55.96 | 25.34,55.96 25.34,58.43 R26.1 | R28.2 22.8,53.42 25.34,55.96
N$64
  Top 0.8: IC1.60 133.41,74.97 133.4,74.98
  Top 0.93: 133.4,74.98 133.4,80.15 ANT.1
N$65
  Top 0.61: IC1.52 147.03,73.26 150.37,69.93 150.37,67.77 R21.1
N$66
  Top 0.406: T13.1 152.14,61.48 150.37,63.26 150.37,64.72 R21.2
N$67  (via drill 0.6 pad 1.68)
  Top 0.406: T13.3 152.89,58.48 154.18,59.77 v154.18,66.44
  Bottom 0.406: v154.18,66.44 154.18,82.63 LED_GND.1
N$68  (via drill 0.6 pad 1.68)
  Top 0.406: v149.1,81.99 148.46,81.99 146.56,83.9 145.83,83.9 R22.1
  Bottom 0.406: LED_3V.1 v149.1,81.99
N$69
  Top 0.406: X2.C1 131.44,32.25 130.13,33.56 130.13,35.04 C9.2 130.07,35.14 131.08,35.14 132.03,36.1 132.03,39.27 137.41,44.65 IC1.30
N$70
  Top 0.406: X2.C2 133.97,35.12 R23.2
N$71
  Top 0.406: X2.C3 136.75,30.83 138.84,32.92 138.84,35.16 R24.2
N$72
  Top 0.406: R25.1 146.24,10.71 C8.2 143.29,5.13 X2.C7
  Top 0.61: 146.46,10.49 R25.1
N$73
  Top 0.406: IC1.33 140.41,36.81 140.16,36.55 135.48,36.55 R23.1
N$74
  Top 0.406: IC1.32 139.41,41.25 138.7,40.54 138.7,38.1 R24.1
N$75
  Top 0.406: IC1.31 138.41,52.6 138.68,52.86 142.64,52.86 144.62,50.88 144.62,15.13 R25.2
N$79  (via drill 0.6 pad 1.68)
  Top 0.406: IC3.8 93.84,57.21 93.53,56.91 93.53,55.96 92.9,55.32 88.45,55.32 v87.82,55.96 87.82,56.91 86.55,58.18 C16.1
  Bottom 0.406: 91,53.73 Q1.1 91.31,54.05 89.41,55.96 v87.82,55.96
PWRKEY
  Top 0.406: IC3.40 100.99,66.27 101.79,67.07 101.79,68.27 R13.1
RELAY_DETECT_1  (via drill 0.6 pad 1.68)
  Top 0.406: IC3.21 104.99,49.9 106.55,48.34 106.55,40.72 104.97,39.13 102.11,39.13 101.47,39.77 101.47,40.72 100.2,41.99 84.64,41.99 81.79,39.13 76.39,39.13 73.22,35.95 64.96,35.95 63.69,37.23 56.7,37.23 54.92,35.45 R4.2 54.92,32.65 52.34,30.06 52.34,28.1 v52.26,28.02
  Bottom 0.61: X6.5 41.2,11.75 42.15,10.79 48.31,10.79 49.8,12.29 49.8,18.63 47.26,21.17 47.26,26.83 48.45,28.02 v52.26,28.02
RELAY_DETECT_2  (via drill 0.6 pad 1.68)
  Top 0.406: IC3.22 105.79,50.05 107.19,48.66 107.19,40.4 104.97,38.18 99.47,38.18 98.38,39.27 93.93,39.27 92.34,37.68 77.83,37.68 v77.66,37.86
  Top 0.61: v76.39,28.02 76.39,29.67 77.42,30.7 77.42,32.8 R3.2
  Bottom 0.61: v77.66,37.86 77.66,34.68 75.75,32.78 75.75,28.65 v76.39,28.02 | X7.5 64.33,13.33 69.27,13.33 76.47,20.54 76.47,27.94 v76.39,28.02 | 76.07,28.34 v76.39,28.02
RELAY_DETECT_3  (via drill 0.6 pad 1.68)
  Top 0.406: IC3.23 110.23,54.81 110.68,54.37 110.68,48.97 108.14,46.43 108.14,40.4 105.11,37.37 96.79,37.37 96.3,37.86 v95.76,37.86 | v95.44,31.83 95.66,31.83 96.47,31.02 99.97,31.02 100.6,31.65 100.6,33.12 R2.2
  Bottom 0.61: v95.44,31.83 95.44,33.41 | 95.44,33.41 94.49,34.37 89.41,34.37 85.92,30.88 X8.5 | 95.44,33.41 95.44,37.54 v95.76,37.86
RELAY_DETECT_4  (via drill 0.6 pad 1.68)
  Top 0.406: IC3.24 110.7,55.62 111.31,55 111.31,46.75 v110.36,45.8 | v115.12,41.03 R1.2
  Bottom 0.406: v110.36,45.8 111,45.8 115.12,41.67 v115.12,41.03
  Bottom 0.61: v115.12,41.03 115.12,30.56 116.39,29.29 118.62,29.29 119.57,28.34 119.57,26.11 118.44,24.98 116.16,24.98 114.89,23.72 114.89,12.29 112.76,10.16 110.05,10.16 108.78,11.43 X9.5
RESET  (via drill 0.5 pad 1.68)
  Top 0.406: IC3.4 94.16,60.41 91.63,62.94 91.63,67.71 91.31,68.02 89.93,68.02 R17.2
  Top 0.61: R17.2 89.88,70.09 v89.72,70.25
  Bottom 0.406: U$1.RST 101.47,79.14 98.61,76.28 98.61,73.1 97.34,71.83 90.36,71.83 89.72,71.2 v89.72,70.25
SCK  (via drill 0.5 pad 1.68, 0.6 pad 1.68)
  Top 0.406: IC3.3 94.31,61.21 92.58,62.94 92.58,68.34 94.81,70.56 v94.81,74.37 93.85,74.37 93.22,75.01 93.22,77.55 93.85,78.18 97.34,78.18 100.84,74.69 111.31,74.69 114.17,71.83 114.17,43.26 110.2,39.29 110.2,38.02 v110.36,37.86 111,37.86
  Bottom 0.406: U$1.SCK 102.74,80.72 98.93,80.72 96.39,78.18 96.39,75.01 95.76,74.37 v94.81,74.37
  Bottom 0.61: v110.36,37.86 110.36,39.13 107.5,41.99 39.24,41.99 34.84,37.59 34.84,13.65 36.12,12.38 X6.1 36.12,10.79 38.02,8.89 54.8,8.89 | 54.8,8.89 X7.1 | X8.1 80.83,11.43 78.3,8.89 | 78.3,8.89 54.8,8.89 | 78.3,8.89 100.52,8.89 X9.1
VCC_DETECT
  Top 0.406: R16.2 87.61,48.66 86.89,47.94 T11.3 | 87.61,47.91 87.93,47.91 89.41,46.43 93.22,46.43 94.49,47.7 94.49,50.88 96.71,53.1 96.71,53.73 98.61,55.64 98.61,64.59 IC3.43
  Top 0.61: 87.61,48.66 87.61,47.91
WS28_DATA  (via drill 0.6 pad 1.68)
  Top 0.406: IC3.42 99.39,66.3 97.98,67.71 v96.71,67.71
  Bottom 0.61: SDO.1 83.69,76.28 83.69,68.66 85.6,66.75 95.76,66.75 v96.71,67.71

### Text on the board
Top: jTech | HCM-T1
Bottom: BOTTOM